# Altium schematic sheet SignalOutput.SchDoc: Signal output
size A3; Author: eldar6776@hotmail.com; DrawnBy: Eldar Dedić; Organization: PROVEN d.o.o.; Address1: Adema Buće 102; Address2: 71000 Sarajevo; Address3: Federacija BiH; Address4: Bosna i Hercegovina; DocumentNumber: DE211213; Revision: 001; SheetNumber: 11; SheetTotal: 15; ProjectName: MIKSER SIROVINE
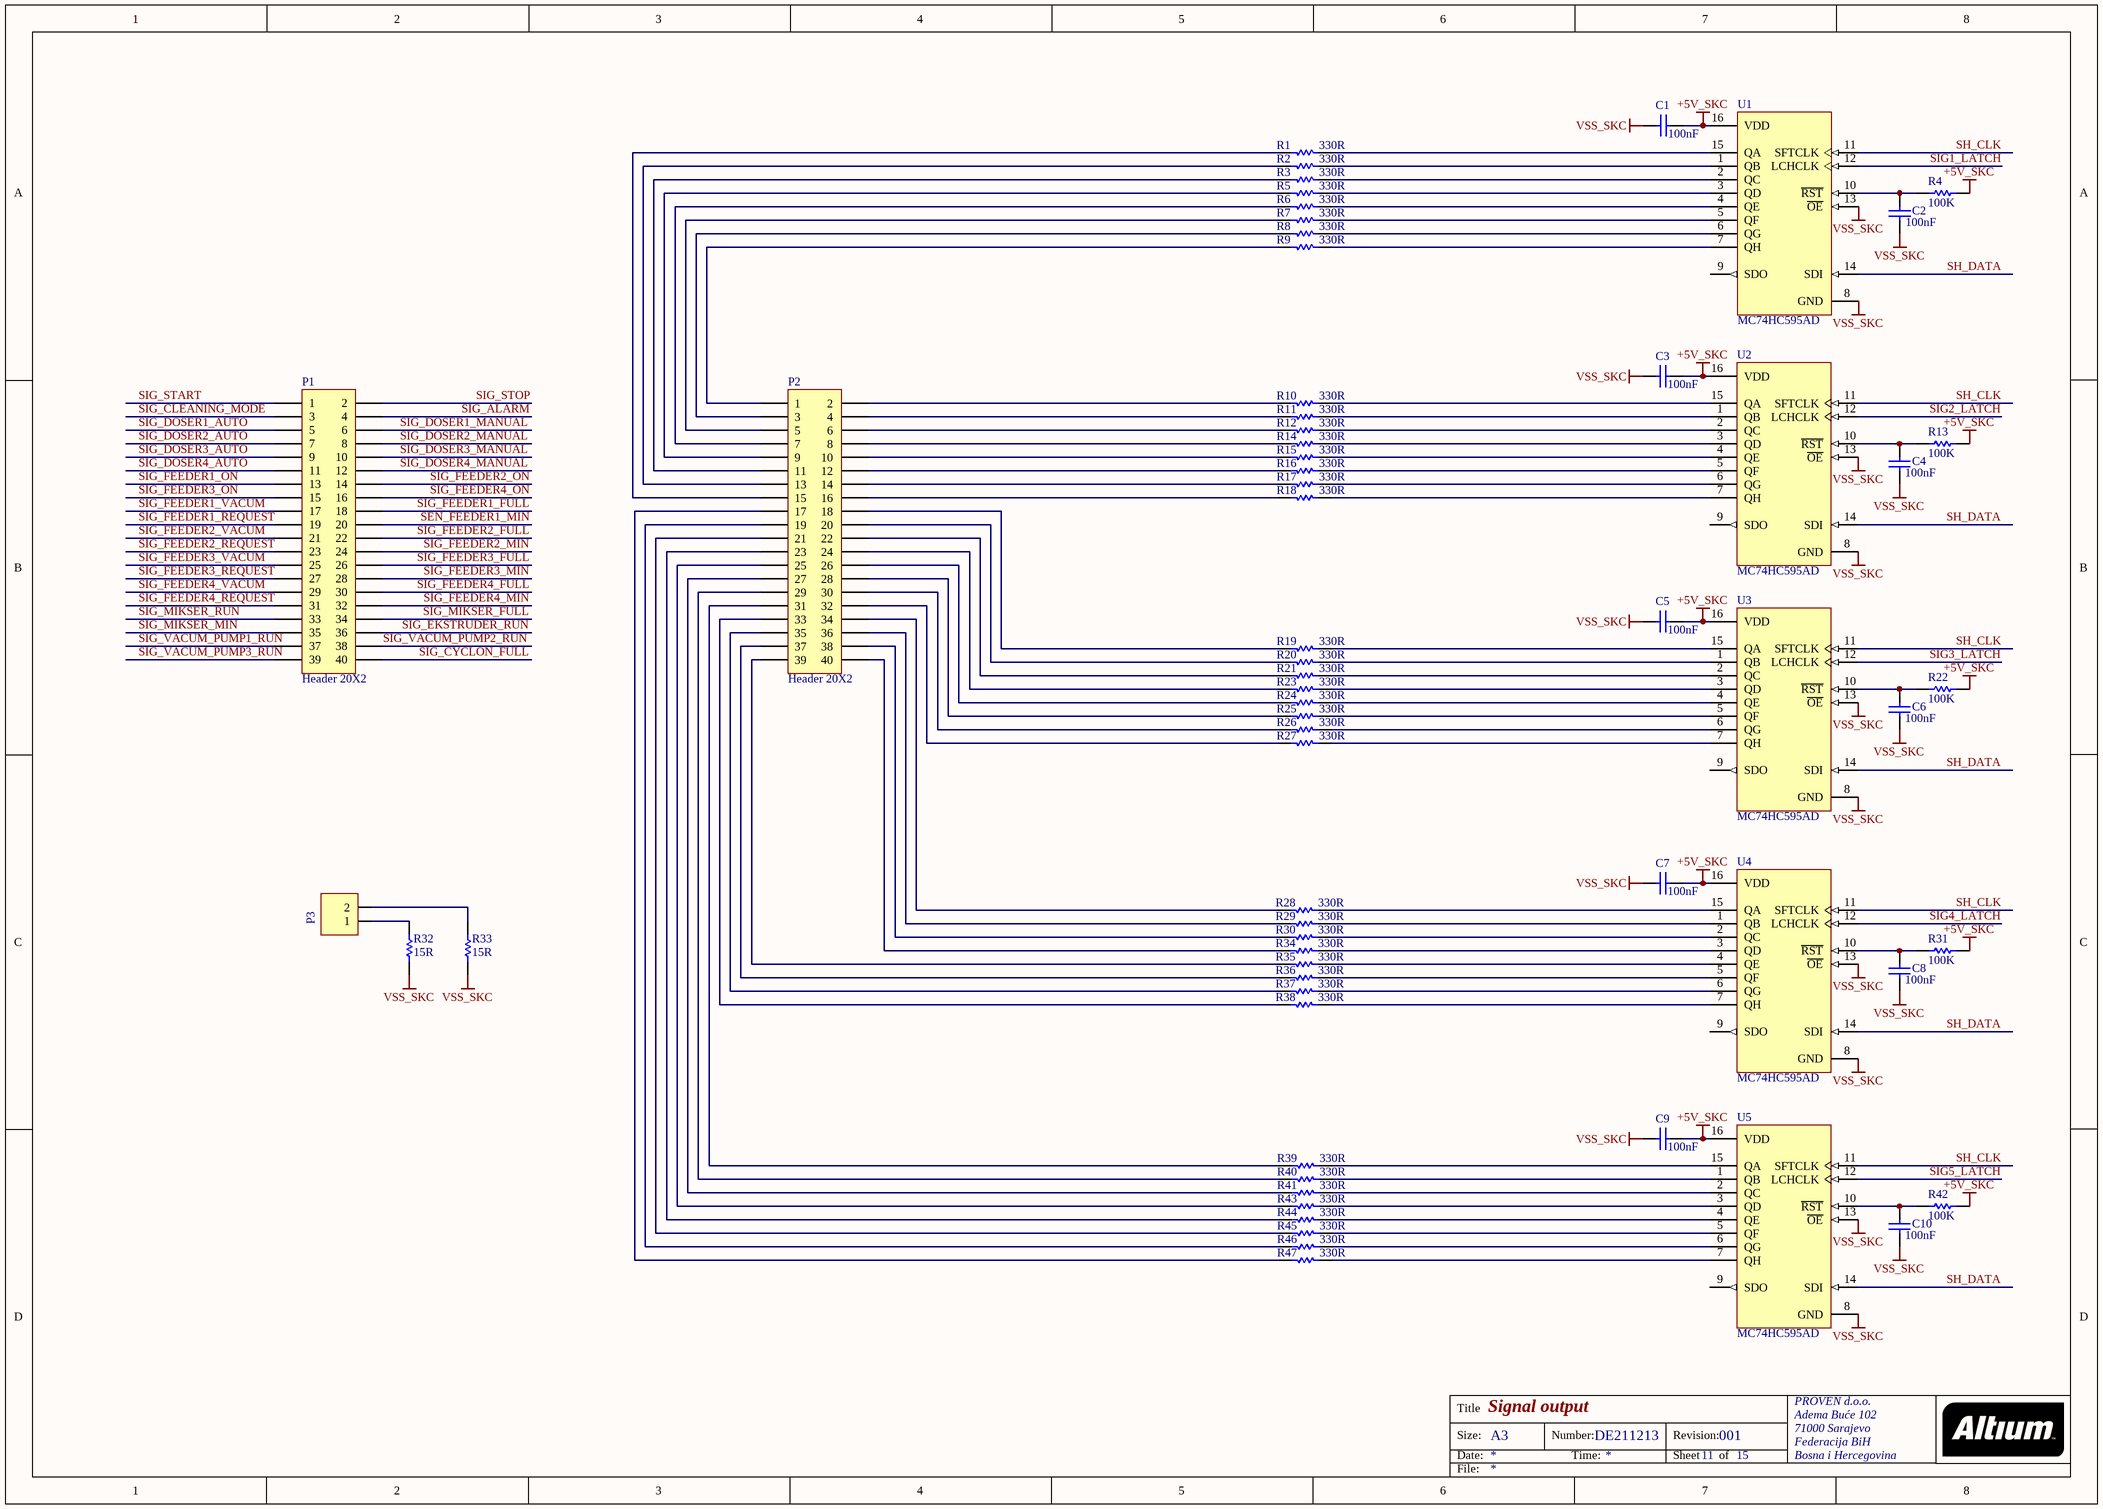
[diagram p0: SignalOutput.SchDoc]

## Parts
C1  value 100nF  [1206]
C2  value 100nF  [1206]
C3  value 100nF  [1206]
C4  value 100nF  [1206]
C5  value 100nF  [1206]
C6  value 100nF  [1206]
C7  value 100nF  [1206]
C8  value 100nF  [1206]
C9  value 100nF  [1206]
C10  value 100nF  [1206]
P1  Header 20X2  [HDR2X20]
P2  Header 20X2  [HDR2X20]
P3  (no value)  [TERMINAL BLOK 2]
R1  330R  [ERA-0805]
R2  330R  [ERA-0805]
R3  330R  [ERA-0805]
R4  100K  [ERA-0603]
R5  330R  [ERA-0805]
R6  330R  [ERA-0805]
R7  330R  [ERA-0805]
R8  330R  [ERA-0805]
R9  330R  [ERA-0805]
R10  330R  [ERA-0805]
R11  330R  [ERA-0805]
R12  330R  [ERA-0805]
R13  100K  [ERA-0603]
R14  330R  [ERA-0805]
R15  330R  [ERA-0805]
R16  330R  [ERA-0805]
R17  330R  [ERA-0805]
R18  330R  [ERA-0805]
R19  330R  [ERA-0805]
R20  330R  [ERA-0805]
R21  330R  [ERA-0805]
R22  100K  [ERA-0603]
R23  330R  [ERA-0805]
R24  330R  [ERA-0805]
R25  330R  [ERA-0805]
R26  330R  [ERA-0805]
R27  330R  [ERA-0805]
R28  330R  [ERA-0805]
R29  330R  [ERA-0805]
R30  330R  [ERA-0805]
R31  100K  [ERA-0603]
R32  15R  [RD6.35x2.3]
R33  15R  [RD6.35x2.3]
R34  330R  [ERA-0805]
R35  330R  [ERA-0805]
R36  330R  [ERA-0805]
R37  330R  [ERA-0805]
R38  330R  [ERA-0805]
R39  330R  [ERA-0805]
R40  330R  [ERA-0805]
R41  330R  [ERA-0805]
R42  100K  [ERA-0603]
R43  330R  [ERA-0805]
R44  330R  [ERA-0805]
R45  330R  [ERA-0805]
R46  330R  [ERA-0805]
R47  330R  [ERA-0805]
U1  MC74HC595AD  [751B-05_N]
U2  MC74HC595AD  [751B-05_N]
U3  MC74HC595AD  [751B-05_N]
U4  MC74HC595AD  [751B-05_N]
U5  MC74HC595AD  [751B-05_N]

## Nets
+5V_SKC: C1.1 C3.1 C5.1 C7.1 C9.1 R4.2 R13.2 R22.2 R31.2 R42.2 U1.16(VDD) U2.16(VDD) U3.16(VDD) U4.16(VDD) U5.16(VDD)
VSS_SKC: C1.2 C2.1 C3.2 C4.1 C5.2 C6.1 C7.2 C8.1 C9.2 C10.1 R32.1 R33.2 U1.8(GND) U1.13(~{OE}) U2.8(GND) U2.13(~{OE}) U3.8(GND) U3.13(~{OE}) U4.8(GND) U4.13(~{OE}) U5.8(GND) U5.13(~{OE})
SEN_FEEDER1_MIN: P1.20
SH_CLK: U1.11(SFTCLK) U2.11(SFTCLK) U3.11(SFTCLK) U4.11(SFTCLK) U5.11(SFTCLK)
SH_DATA: U1.14(SDI) U2.14(SDI) U3.14(SDI) U4.14(SDI) U5.14(SDI)
SIG1_LATCH: U1.12(LCHCLK)
SIG2_LATCH: U2.12(LCHCLK)
SIG3_LATCH: U3.12(LCHCLK)
SIG4_LATCH: U4.12(LCHCLK)
SIG5_LATCH: U5.12(LCHCLK)
SIG_ALARM: P1.4
SIG_CLEANING_MODE: P1.3
SIG_CYCLON_FULL: P1.40
SIG_DOSER1_AUTO: P1.5
SIG_DOSER1_MANUAL: P1.6
SIG_DOSER2_AUTO: P1.7
SIG_DOSER2_MANUAL: P1.8
SIG_DOSER3_AUTO: P1.9
SIG_DOSER3_MANUAL: P1.10
SIG_DOSER4_AUTO: P1.11
SIG_DOSER4_MANUAL: P1.12
SIG_EKSTRUDER_RUN: P1.36
SIG_FEEDER1_FULL: P1.18
SIG_FEEDER1_ON: P1.13
SIG_FEEDER1_REQUEST: P1.19
SIG_FEEDER1_VACUM: P1.17
SIG_FEEDER2_FULL: P1.22
SIG_FEEDER2_MIN: P1.24
SIG_FEEDER2_ON: P1.14
SIG_FEEDER2_REQUEST: P1.23
SIG_FEEDER2_VACUM: P1.21
SIG_FEEDER3_FULL: P1.26
SIG_FEEDER3_MIN: P1.28
SIG_FEEDER3_ON: P1.15
SIG_FEEDER3_REQUEST: P1.27
SIG_FEEDER3_VACUM: P1.25
SIG_FEEDER4_FULL: P1.30
SIG_FEEDER4_MIN: P1.32
SIG_FEEDER4_ON: P1.16
SIG_FEEDER4_REQUEST: P1.31
SIG_FEEDER4_VACUM: P1.29
SIG_MIKSER_FULL: P1.34
SIG_MIKSER_MIN: P1.35
SIG_MIKSER_RUN: P1.33
SIG_START: P1.1
SIG_STOP: P1.2
SIG_VACUM_PUMP1_RUN: P1.37
SIG_VACUM_PUMP2_RUN: P1.38
SIG_VACUM_PUMP3_RUN: P1.39
NetC2_2: C2.2 R4.1 U1.10(~{RST})
NetC4_2: C4.2 R13.1 U2.10(~{RST})
NetC6_2: C6.2 R22.1 U3.10(~{RST})
NetC8_2: C8.2 R31.1 U4.10(~{RST})
NetC10_2: C10.2 R42.1 U5.10(~{RST})
NetP2_1: P2.1 R9.1
NetP2_2: P2.2 R10.1
NetP2_3: P2.3 R8.1
NetP2_4: P2.4 R11.1
NetP2_5: P2.5 R7.1
NetP2_6: P2.6 R12.1
NetP2_7: P2.7 R6.1
NetP2_8: P2.8 R14.1
NetP2_9: P2.9 R5.1
NetP2_10: P2.10 R15.1
NetP2_11: P2.11 R3.1
NetP2_12: P2.12 R16.1
NetP2_13: P2.13 R2.1
NetP2_14: P2.14 R17.1
NetP2_15: P2.15 R1.1
NetP2_16: P2.16 R18.1
NetP2_17: P2.17 R47.1
NetP2_18: P2.18 R19.1
NetP2_19: P2.19 R46.1
NetP2_20: P2.20 R20.1
NetP2_21: P2.21 R45.1
NetP2_22: P2.22 R21.1
NetP2_23: P2.23 R44.1
NetP2_24: P2.24 R23.1
NetP2_25: P2.25 R43.1
NetP2_26: P2.26 R24.1
NetP2_27: P2.27 R41.1
NetP2_28: P2.28 R25.1
NetP2_29: P2.29 R40.1
NetP2_30: P2.30 R26.1
NetP2_31: P2.31 R39.1
NetP2_32: P2.32 R27.1
NetP2_33: P2.33 R38.1
NetP2_34: P2.34 R28.1
NetP2_35: P2.35 R37.1
NetP2_36: P2.36 R29.1
NetP2_37: P2.37 R36.1
NetP2_38: P2.38 R30.1
NetP2_39: P2.39 R35.1
NetP2_40: P2.40 R34.1
NetP3_1: P3.1 R32.2
NetP3_2: P3.2 R33.1
NetR1_2: R1.2 U1.15(QA)
NetR2_2: R2.2 U1.1(QB)
NetR3_2: R3.2 U1.2(QC)
NetR5_2: R5.2 U1.3(QD)
NetR6_2: R6.2 U1.4(QE)
NetR7_2: R7.2 U1.5(QF)
NetR8_2: R8.2 U1.6(QG)
NetR9_2: R9.2 U1.7(QH)
NetR10_2: R10.2 U2.15(QA)
NetR11_2: R11.2 U2.1(QB)
NetR12_2: R12.2 U2.2(QC)
NetR14_2: R14.2 U2.3(QD)
NetR15_2: R15.2 U2.4(QE)
NetR16_2: R16.2 U2.5(QF)
NetR17_2: R17.2 U2.6(QG)
NetR18_2: R18.2 U2.7(QH)
NetR19_2: R19.2 U3.15(QA)
NetR20_2: R20.2 U3.1(QB)
NetR21_2: R21.2 U3.2(QC)
NetR23_2: R23.2 U3.3(QD)
NetR24_2: R24.2 U3.4(QE)
NetR25_2: R25.2 U3.5(QF)
NetR26_2: R26.2 U3.6(QG)
NetR27_2: R27.2 U3.7(QH)
NetR28_2: R28.2 U4.15(QA)
NetR29_2: R29.2 U4.1(QB)
NetR30_2: R30.2 U4.2(QC)
NetR34_2: R34.2 U4.3(QD)
NetR35_2: R35.2 U4.4(QE)
NetR36_2: R36.2 U4.5(QF)
NetR37_2: R37.2 U4.6(QG)
NetR38_2: R38.2 U4.7(QH)
NetR39_2: R39.2 U5.15(QA)
NetR40_2: R40.2 U5.1(QB)
NetR41_2: R41.2 U5.2(QC)
NetR43_2: R43.2 U5.3(QD)
NetR44_2: R44.2 U5.4(QE)
NetR45_2: R45.2 U5.5(QF)
NetR46_2: R46.2 U5.6(QG)
NetR47_2: R47.2 U5.7(QH)

Not connected (* = marked no-connect by the designer): U1 9(SDO); U2 9(SDO); U3 9(SDO); U4 9(SDO); U5 9(SDO)

## Notes on the sheet
- Title
- Size:
- Date:
- A3
- Number:
- Time:
- Revision:
- Sheet
- of
- File:

## Library data of the parts
C1-C10 = C1206: Ceramic Chip Capacitor - Standard; Published: 17-Jul-2002; LatestRevisionDate: 19-Mar-2004; LatestRevisionNote: Silkscreen size reduced.; DatasheetDocument: Mar-2001; PackageDocument: Mar-2001; PackageReference: 1206; Publisher: Altium Limited; Code_JEITA: 1206; Code_IPC: 3216 [1206]; ComponentLink1Description: Manufacturer Link; ComponentLink1URL: http://www.kemet.com/; ComponentLink2Description: Datasheet; ComponentLink2URL: http://www.kemet.com/kemet/web/homepage/kechome.nsf/vapubfilesname/F3102TA.pdf/$file/F3102TA.pdf
P1 P2 = Header 20X2: Header, 20-Pin, Dual row; LatestRevisionDate: 17-Jul-2002; LatestRevisionNote: Re-released for DXP Platform.; Publisher: Altium Limited
P3 = Terminal blok 2 pina: Terminal blok 2
R1-R3 R5-R12 R14-R21 R23-R30 R34-R41 R43-R47 = ERA6Y: Rectangular Thick Film Chip Resistor, 10 Ohm to 1M Ohm Range, 0.1% and 0.5% Tolerance, 0805 Size, 0.1 W; Note: If flow soldering, adjust pad width of PCB Footprint to 0.7 - 0.8 times the width of the resistor.; Published: 17-Dec-2003; LatestRevisionDate: 19-Mar-2004; LatestRevisionNote: Silkscreen size reduced.; PackageDocument: Mar-2003; PackageReference: ERA-0805; Publisher: Altium Limited; Code_IPC: 2012 [0805]; ComponentLink1Description: Manufacturer Link; ComponentLink1URL: http://www.panasonic.com/industrial/components/resistive_products.htm; ComponentLink2Description: Datasheet; ComponentLink2URL: http://www.panasonic.com/industrial/components/pdf/AOA0000CE8.pdf
R4 R13 R22 R31 R42 = ERA3Y: Rectangular Thick Film Chip Resistor, 10 Ohm to 330k Ohm Range, 0.1% and 0.5% Tolerance, 0603 Size, 0.063 W; Note: If flow soldering, adjust pad width of PCB Footprint to 0.7 - 0.8 times the width of the resistor.; Published: 17-Dec-2003; LatestRevisionDate: 19-Mar-2004; LatestRevisionNote: Silkscreen size reduced.; PackageDocument: Mar-2003; PackageReference: ERA-0603; Publisher: Altium Limited; Code_IPC: 1608 [0603]; ComponentLink1Description: Manufacturer Link; ComponentLink1URL: http://www.panasonic.com/industrial/components/resistive_products.htm; ComponentLink2Description: Datasheet; ComponentLink2URL: http://www.panasonic.com/industrial/components/pdf/AOA0000CE8.pdf
R32 R33 = ERD25T: Carbon Film Resistor, 1 Ohm to 3.3M Ohm Range, 5% Tolerance, 0.25 W; Published: 17-Dec-2003; PackageReference: RD6.35x2.3; Publisher: Altium Limited; ComponentLink1Description: Manufacturer Link; ComponentLink1URL: http://www.panasonic.com/industrial/components/resistive_products.htm; ComponentLink2Description: Datasheet; ComponentLink2URL: http://www.panasonic.com/industrial/components/pdf/AOA0000CE12.pdf
U1-U5 = MC74HC595AD: 8-Bit Serial-Input/Serial or Prallel-Output Shift Register with Latched 3-State Outputs; Published: 15-Apr-2002; LatestRevisionDate: 13-Apr-2006; LatestRevisionNote: IPC-7351 Footprint Added.; DatasheetVersion: Mar-2000; PackageVersion: Oct-1999; PackageReference: 751B-05; Publisher: Altium Limited; PackageDescription: 16-Pin Small Outline Integrated Circuit 1.27 mm Pitch; Code_JEDEC: MS-012-AC; Code_IPC: SOIC127P600-16; ComponentLink1Description: Manufacturer Link; ComponentLink1URL: http://www.onsemi.com/; ComponentLink2Description: Datasheet; ComponentLink2URL: http://www.onsemi.com/pub/Collateral/MC74HC595A-D.PDF